# Altium schematic sheet Sheet1.SchDoc
size A
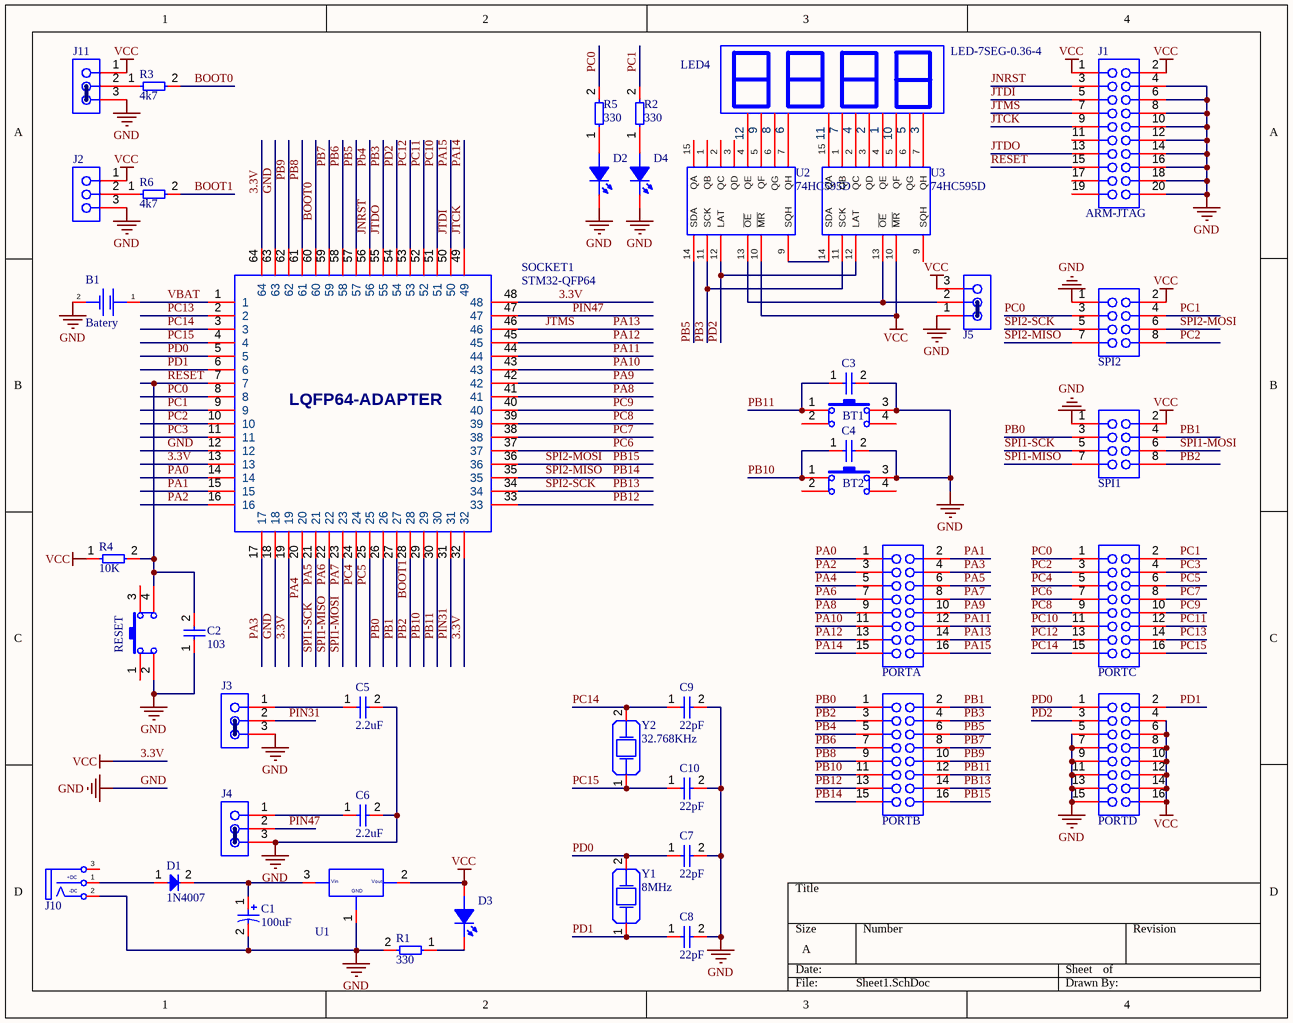
[diagram p0: Sheet1.SchDoc]

## Parts
B1  Batery  [CR1220]
BT1  Button Hole  [BUTTON_HOLE_5.0mm]  (value not drawn)
BT2  Button Hole  [BUTTON_HOLE_5.0mm]  (value not drawn)
C1  100uF  [CAP_RAD_7mm]
C2  103  [C0805]
C3  103  [C0805]  (value not drawn)
C4  103  [C0805]  (value not drawn)
C5  2.2uF  [C1206]
C6  2.2uF  [C1206]
C7  22pF  [C0805]
C8  22pF  [C0805]
C9  22pF  [C0805]
C10  22pF  [C0805]
D1  1N4007  [DO-41]
D2  LED0805  [L0805RED]  (value not drawn)
D3  LED0805  [L0805RED]  (value not drawn)
D4  LED0805  [L0805RED]  (value not drawn)
J1  ARM-JTAG  [IDC_CONNECTOR_20_2.54]
J2  BOOT1  [Header 3x1 TH Pitch 2.54mm]  (value not drawn)
J3  PIN31  [Header 3x1 TH Pitch 2.54mm]  (value not drawn)
J4  PIN47  [Header 3x1 TH Pitch 2.54mm]  (value not drawn)
J5  7SEG-OE  [Header 3x1 TH Pitch 2.54mm]  (value not drawn)
J10  Connector  [DC_K375A_Power]  (value not drawn)
J11  BOOT0  [Header 3x1 TH Pitch 2.54mm]  (value not drawn)
LED4  LED-7SEG-0.36-4  [LED-7SEG-0.36-4]
PORTA  Header 8x2 TH Pitch 2.54mm  [Header 8x2 TH Pitch 2.54mm]  (value not drawn)
PORTB  Header 8x2 TH Pitch 2.54mm  [Header 8x2 TH Pitch 2.54mm]  (value not drawn)
PORTC  Header 8x2 TH Pitch 2.54mm  [Header 8x2 TH Pitch 2.54mm]  (value not drawn)
PORTD  Header 8x2 TH Pitch 2.54mm  [Header 8x2 TH Pitch 2.54mm]  (value not drawn)
R1  330  [RES-0.25W-H-MF]
R2  330  [R0805]
R3  4k7  [R0805]
R4  10K  [RES-0.25W-H-MF]
R5  330  [R0805]
R6  4k7  [R0805]
RESET  Button Hole  [BUTTON_HOLE_5.0mm]  (value not drawn)
SOCKET1  STM32-QFP64  [SOCKET-ADAPTER-OTQ-64-05-03]
SPI1  Header 4x2 TH Pitch 2.54mm  [Header 4x2 TH Pitch 2.54mm]  (value not drawn)
SPI2  Header 4x2 TH Pitch 2.54mm  [Header 4x2 TH Pitch 2.54mm]  (value not drawn)
U1  AMS1117  [SOT223-3]  (value not drawn)
U2  74HC595D  [SO16]
U3  74HC595D  [SO16]
Y1  8MHz  [SMD5032]
Y2  32.768KHz  [DT-26]

## Nets
3.3V: D3.1(A) J1.1 J1.2 J2.1 J5.3 J11.1 PORTD.4 PORTD.6 PORTD.8 PORTD.10 PORTD.12 PORTD.14 PORTD.16 R4.1 SOCKET1.13 SOCKET1.19 SOCKET1.32 SOCKET1.48 SOCKET1.64 SPI1.2 SPI2.2 U1.2 U2.10(~{MR}) U2.16 U3.10(~{MR}) U3.16  [also labelled VCC]
GND: B1.2 BT1.3 BT2.3 C1.2 C2.1 C3.2 C4.2 C5.2 C6.2 C7.2 C8.2 C9.2 C10.2 D2.2(K) D4.2(K) J1.4 J1.6 J1.8 J1.10 J1.12 J1.14 J1.16 J1.18 J1.20 J2.3 J3.3 J4.3 J5.1 J10.2(DC-) J11.3 PORTD.5 PORTD.7 PORTD.9 PORTD.11 PORTD.13 PORTD.15 R1.2 RESET.2 SOCKET1.12 SOCKET1.18 SOCKET1.63 SPI1.1 SPI2.1 U1.1 U2.8 U3.8
BOOT0: R3.2 SOCKET1.60
BOOT1: PORTB.3 R6.2 SOCKET1.28 SPI1.8  [also labelled PB2]
JNRST: J1.3 PORTB.5 SOCKET1.56  [also labelled Pb4]
JTCK: J1.9 PORTA.15 SOCKET1.49  [also labelled PA14]
JTDI: J1.5 PORTA.16 SOCKET1.50  [also labelled PA15]
JTDO: J1.13 PORTB.4 SOCKET1.55 U2.11(SCK) U3.11(SCK)  [also labelled PB3]
JTMS: J1.7 PORTA.14 SOCKET1.46  [also labelled PA13]
PA0: PORTA.1 SOCKET1.14
PA1: PORTA.2 SOCKET1.15
PA2: PORTA.3 SOCKET1.16
PA3: PORTA.4 SOCKET1.17
PA4: PORTA.5 SOCKET1.20
PA5: PORTA.6 SOCKET1.21 SPI1.5  [also labelled SPI1-SCK]
PA6: PORTA.7 SOCKET1.22 SPI1.7  [also labelled SPI1-MISO]
PA7: PORTA.8 SOCKET1.23 SPI1.6  [also labelled SPI1-MOSI]
PA8: PORTA.9 SOCKET1.41
PA9: PORTA.10 SOCKET1.42
PA10: PORTA.11 SOCKET1.43
PA11: PORTA.12 SOCKET1.44
PA12: PORTA.13 SOCKET1.45
PB0: PORTB.1 SOCKET1.26 SPI1.3
PB1: PORTB.2 SOCKET1.27 SPI1.4
PB5: PORTB.6 SOCKET1.57 U2.14(SDA)
PB6: PORTB.7 SOCKET1.58
PB7: PORTB.8 SOCKET1.59
PB8: PORTB.9 SOCKET1.61
PB9: PORTB.10 SOCKET1.62
PB10: BT2.1 C4.1 PORTB.11 SOCKET1.29
PB11: BT1.1 C3.1 PORTB.12 SOCKET1.30
PB12: PORTB.13 SOCKET1.33
PB13: PORTB.14 SOCKET1.34 SPI2.5  [also labelled SPI2-SCK]
PB14: PORTB.15 SOCKET1.35 SPI2.7  [also labelled SPI2-MISO]
PB15: PORTB.16 SOCKET1.36 SPI2.6  [also labelled SPI2-MOSI]
PC0: PORTC.1 R5.2 SOCKET1.8 SPI2.3
PC1: PORTC.2 R2.2 SOCKET1.9 SPI2.4
PC2: PORTC.3 SOCKET1.10 SPI2.8
PC3: PORTC.4 SOCKET1.11
PC4: PORTC.5 SOCKET1.24
PC5: PORTC.6 SOCKET1.25
PC6: PORTC.7 SOCKET1.37
PC7: PORTC.8 SOCKET1.38
PC8: PORTC.9 SOCKET1.39
PC9: PORTC.10 SOCKET1.40
PC10: PORTC.11 SOCKET1.51
PC11: PORTC.12 SOCKET1.52
PC12: PORTC.13 SOCKET1.53
PC13: PORTC.14 SOCKET1.2
PC14: C9.1 PORTC.15 SOCKET1.3 Y2.2
PC15: C10.1 PORTC.16 SOCKET1.4 Y2.1
PD0: C7.1 PORTD.1 SOCKET1.5 Y1.2
PD1: C8.1 PORTD.2 SOCKET1.6 Y1.1
PD2: PORTD.3 SOCKET1.54 U2.12(LAT) U3.12(LAT)
PIN31: J3.2 SOCKET1.31
PIN47: J4.2 SOCKET1.47
RESET: C2.2 J1.15 R4.2 RESET.4 SOCKET1.7
VBAT: B1.1 SOCKET1.1
NetC1_1: C1.1 D1.2 U1.3
NetC5_1: C5.1 J3.1
NetC6_1: C6.1 J4.1
NetD1_1: D1.1 J10.1(DS+)
NetD2_1: D2.1(A) R5.1
NetD3_2: D3.2(K) R1.1
NetD4_1: D4.1(A) R2.1
NetJ2_2: J2.2 R6.1
NetJ5_2: J5.2 U2.13(~{OE}) U3.13(~{OE})
NetJ11_2: J11.2 R3.1
NetLED4_1: LED4.1 U3.4(QE)
NetLED4_2: LED4.2 U3.3(QD)
NetLED4_3: LED4.3 U3.7(QH)
NetLED4_4: LED4.4 U3.2(QC)
NetLED4_5: LED4.5 U3.6(QG)
NetLED4_6: LED4.6 U2.7(QH)
NetLED4_7: LED4.7 U3.1(QB)
NetLED4_8: LED4.8 U2.6(QG)
NetLED4_9: LED4.9 U2.5(QF)
NetLED4_10: LED4.10 U3.5(QF)
NetLED4_11: LED4.11 U3.15(QA)
NetLED4_12: LED4.12 U2.4(QE)
NetU2_9: U2.9(SQH) U3.14(SDA)

Not connected (* = marked no-connect by the designer): BT1 2 4; BT2 2 4; J1 11 17 19; J10 3(T); RESET 1 3; U2 1(QB) 2(QC) 3(QD) 15(QA); U3 9(SQH)

## Notes on the sheet
- (in symbol AMS1117(SOT-223)) Vin; Vout; GND
- (in symbol JackDC) +DC; -DC
- (in symbol SOCKET-ADAPTER-OTQ-64-05-03) LQFP64-ADAPTER

## Library data of the parts
C1 = Capacitor(Radian)
C2-C4 C7-C10 = C0805
C5 C6 = C1206
J1 = IDC_2.54_10x2
J2-J5 J11 = Header 3x1 TH Pitch 2.54mm
J10 = JackDC
R1 R4 = Resistors THD
R2 R3 R5 R6 = Resistor SMD
SOCKET1 = SOCKET-ADAPTER-OTQ-64-05-03
U1 = AMS1117(SOT-223)
Y1 = Crystal
Y2 = Crystal 32.768KHz